# EAGLE design Zio Qwiic Air Quality Sensor CCS811 (EAGLE 9.1.1)
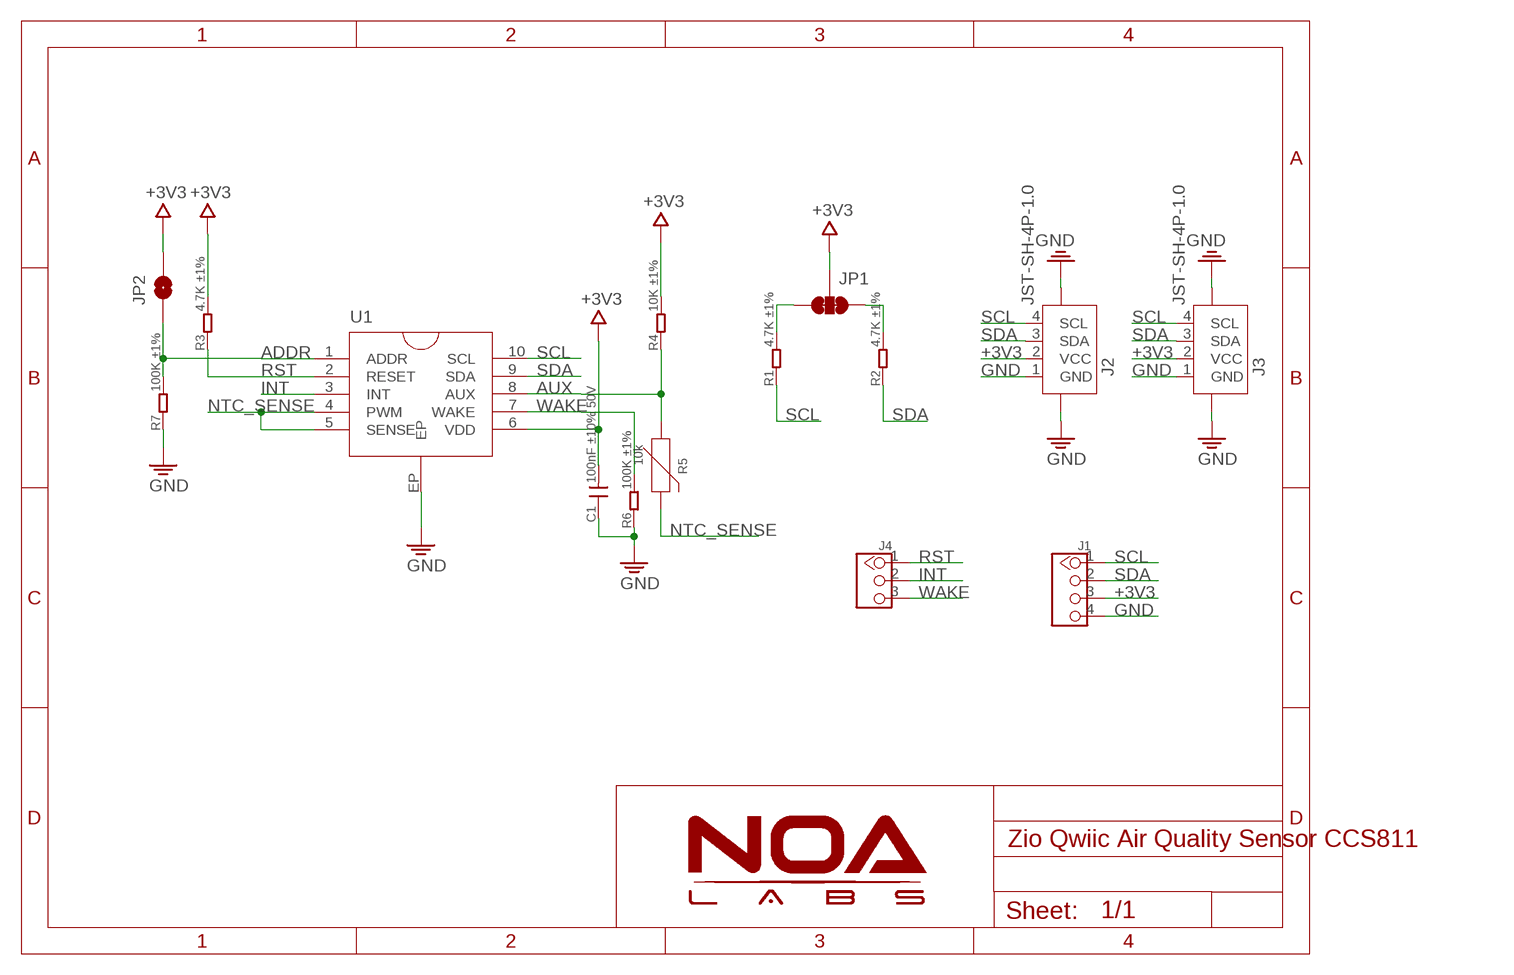
[diagram p0: schematic, sheet 1]

## Parts
C1  100nF ±10% 50V  C-0603  [C0603]
J1  HEADER-4P-60/35MIL  [4P-65/35MIL]
J2  JST-SH-4P-1.0  [JST-SH-4P]
J3  JST-SH-4P-1.0  [JST-SH-4P]
J4  HEADER-3P-2.54  [3P-2.54]
JP1  SMT-JUMPER_3_2-NC_TRACE  [SMT-JUMPER_3_2-NC_TRACE]
JP2  JUMPER-SMT_2_NC_PASTE_NOCREM  [SMT-JUMPER_2_NC_PASTE_SILK_NOCREM]
R1  4.7K ±1%  R-0603  [R0603]
R2  4.7K ±1%  R-0603  [R0603]
R3  4.7K ±1%  R-0603  [R0603]
R4  10K ±1%  R-0603  [R0603]
R5  10k  R-PHOTOVARISTORNTC  [NTC]
R6  100K ±1%  R-0603  [R0603]
R7  100K ±1%  R-0603  [R0603]
U1  CCS811B  [LGA10]

## Nets
+3V3: C1.2 J1.3 J2.2(VCC) J3.2(VCC) JP1.2 JP2.2 R3.2 R4.2 U1.6(VDD)
ADDR: JP2.1 R7.2 U1.1(ADDR)
AUX: R4.1 R5.2 U1.8(AUX)
GND: C1.1 J1.4 J2.1(GND) J2.NC1 J2.NC2 J3.1(GND) J3.NC1 J3.NC2 R6.1 R7.1 U1.EP
INT: J4.2 U1.3(INT)
N$6: JP1.3 R1.2
N$8: JP1.1 R2.2
NTC_SENSE: R5.1 U1.4(PWM) U1.5(SENSE)
RST: J4.1 R3.1 U1.2(RESET)
SCL: J1.1 J2.4(SCL) J3.4(SCL) R1.1 U1.10(SCL)
SDA: J1.2 J2.3(SDA) J3.3(SDA) R2.1 U1.9(SDA)
WAKE: J4.3 R6.2 U1.7(WAKE)

## Library data of the parts
C1 = RCL:C
J1 = Connector_NOA:HEADER-4P
J2 J3 = Connector:JST-SH-4P
J4 = Connector_NOA:HEADER-3P
JP1 = NOA-Jumpers:SMT-JUMPER_3_2-NC_TRACE
JP2 = NOA-Jumpers:JUMPER-SMT_2_NC_PASTE_NOCREM
R1-R4 R6 R7 = RCL:R
R5 = Discretex:R-PHOTOVARISTOR
U1 = IC:CCS811B

## Board
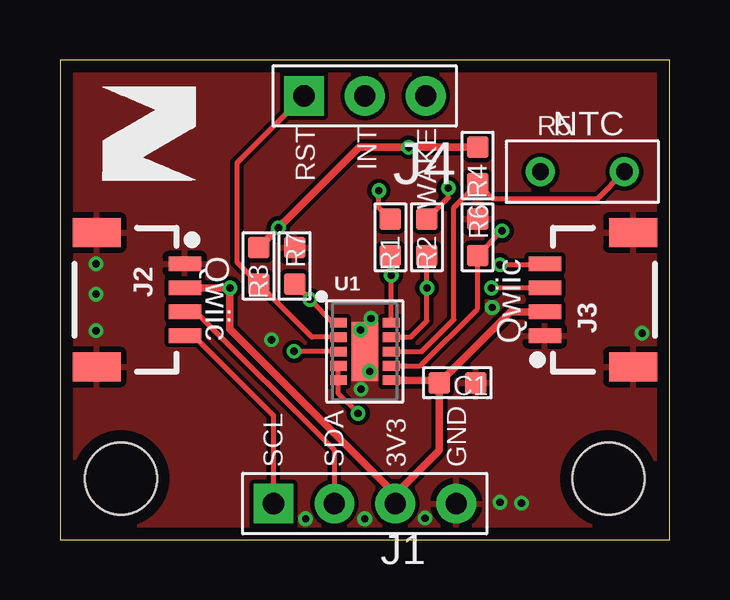
[diagram p1: board, top side]
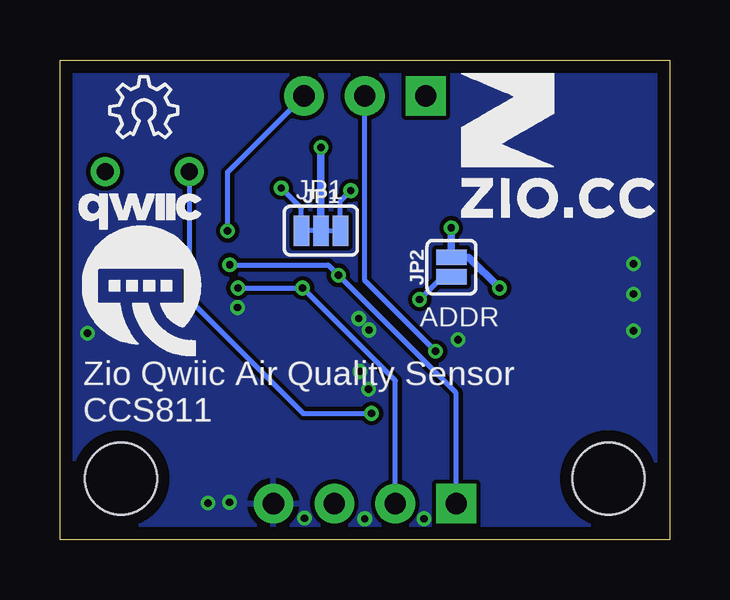
[diagram p2: board, bottom side, seen from below]

Size 25.4 x 20 mm. Coordinates in mm from the lower left corner, seen from the top.
Outline: 0,0 25.4,0 25.4,20 0,20 0,0
Copper layers (1*16): Top 0.035mm / dielectric 1.5mm / Bottom 0.035mm
Design rules "NOA Eagle Rule": minimum track width 7mil, minimum drill 12mil, track to track 7mil, track to pad 7mil, pad to pad 7mil, via to via 7mil, smd to smd 0mil, copper to edge 20mil, drill to drill 10mil, minimum pad ring 10mil, minimum via ring 6mil, stop-mask expansion 2mil, vias tented up to drill 25mil, thermal gap 10mil
Holes 3 mm at 2.54,2.54 22.86,2.54

### Footprints (pad centres in the part's own frame; a part is rotated, then mirrored left to right if it is on the bottom)
C0603 = smd 0.889 x 0.889: 1 -0.762,0; 2 0.762,0
4P-65/35MIL = drill 0.889 pad 1.651 square: 1 0,3.81 | drill 0.889 pad 1.651: 2 0,1.27; 3 0,-1.27; 4 0,-3.81
JST-SH-4P = smd 0.6 x 1.35: 1 1.5,0; 2 0.5,0; 3 -0.5,0; 4 -1.5,0 | smd 1.2 x 2: NC1 -2.8,3.675; NC2 2.8,3.675
3P-2.54 = drill 0.889 pad 1.651 square: 1 0,2.54 | drill 0.889 pad 1.651: 2 0,0; 3 0,-2.54
SMT-JUMPER_3_2-NC_TRACE = smd 0.635 x 1.27: 1 -0.813,0; 2 0,0; 3 0.813,0
SMT-JUMPER_2_NC_PASTE_SILK_NOCREM = smd 0.635 x 1.27: 1 -0.406,0; 2 0.406,0
R0603 = smd 0.889 x 0.889: 1 -0.762,0; 2 0.762,0
NTC = drill 0.7: 1 -1.75,0; 2 1.75,0
LGA10 = smd 0.7 x 0.4: 1 -1.1,1.2; 2 -1.1,0.6; 3 -1.1,0; 4 -1.1,-0.6; 5 -1.1,-1.2; 6 1.1,-1.2; 7 1.1,-0.6; 8 1.1,0; 9 1.1,0.6; 10 1.1,1.2 | smd 1.1 x 2.45: EP 0,0

### Placement (x,y rotation side)
C1  16.56,6.53 180 top
J1  12.7,1.5 90 top
J2  5.2,10 90 top
J3  20.2,10 270 top
J4  12.7,18.5 90 top
JP1  14.53,12.88 0 bottom
JP2  9.09,11.36 90 bottom
R1  13.77,12.61 90 top
R2  15.29,12.61 90 top
R3  8.28,11.41 90 top
R4  17.4,15.6 90 top
R5  21.77,15.34 0 top
R6  17.4,12.61 270 top
R7  9.78,11.41 270 top
U1  12.7,7.84 0 top
U$6  [6MM]  8.71,13.44 0 bottom
U$7  [QWIIC-LOGO-MEDIUM]  22.07,11.1 0 bottom
U$8  [OSHW_6X100_NOTEXT]  23.32,16.76 0 bottom
U$9  [6MM]  1.75,14.96 0 top

### Tracks (layer width: path | path; a pad name or v marks a point on that pad's centre or on a via)
+3V3  (via drill 0.3)
  Top 0.305: U1.6 15.69,6.64 C1.2 | J3.2 18.76,9.5 C1.2 | R3.2 9.32,13.21 | 9.32,13.21 12.46,16.36 v14.53,16.36 R4.2 | v9.1,13 9.31,13.21 9.32,13.21 | J1.3 13.97,1.88 | J2.2 7.08,10.5 | 7.08,10.5 v7.09,10.49 | 7.08,10.5 7.08,8.77 13.8,2.04 | 13.97,1.88 13.8,2.04 | C1.2 15.8,3.71 14.16,2.07 | 14.16,2.07 13.97,1.88 | J1.3 13.97,1.88 | 13.97,1.88 14.16,2.07 | J1.3 13.97,1.88 | 13.97,1.88 13.8,2.04
  Bottom 0.305: JP1.2 v14.53,16.36 | v9.1,13 v9.09,12.99 JP2.2 8.36,11.77 v7.09,10.49
ADDR  (via drill 0.3)
  Top 0.203: U1.1 11.39,9.04 v10.42,10.01 R7.2
  Bottom 0.203: JP2.1 9.47,10.95 v10.42,10.01
AUX
  Top 0.203: U1.8 15.08,7.84 16.41,9.17 16.41,13.84 R4.1 18.01,14.22 22.4,14.22 R5.2
GND  (via drill 0.3)
  other vias: 12.95,9.22 12.52,8.74 12.9,7.01 12.55,6.27 10.24,0.86 12.7,0.86 15.21,0.89 8.81,8.33 1.5,8.71 1.5,10.24 1.5,11.51 19.23,1.52 18.34,1.55 24.26,8.61 18.01,9.68
  pour Bottom: 0,19.99 25.4,19.99 25.4,0 0,0
  pour Top: 0,19.99 25.4,19.99 25.4,0 0,0
INT  (via drill 0.3)
  Top 0.203: U1.3 9.76,7.84 v9.75,7.85
  Bottom 0.203: v9.75,7.85 12.7,10.79 J4.2
N$6  (via drill 0.3)
  Top 0.203: R1.2 13.28,13.85 v13.28,14.55
  Bottom 0.203: JP1.3 13.72,14.12 v13.28,14.55
N$8  (via drill 0.3)
  Top 0.203: R2.2 16.18,14.26 v16.18,14.66
  Bottom 0.203: JP1.1 15.34,13.82 v16.18,14.66
NTC_SENSE  (via drill 0.3)
  Top 0.203: v12.42,5.26 11.6,6.08 U1.5 U1.4
  Bottom 0.203: R5.1 20.02,10.01 15.27,5.26 v12.42,5.26
RST
  Top 0.203: U1.2 10.49,8.44 R3.1 7.37,11.56 7.37,15.71 J4.1
SCL  (via drill 0.3)
  Top 0.203: U1.10 v13.8,11.02 13.8,11.81 R1.1 | J2.4 5.57,8.5 8.89,5.18 J1.1 | J3.4 20.16,11.46 v18.33,11.46
  Bottom 0.203: J1.1 8.89,6.11 v13.8,11.02 14.05,11.27 14.23,11.46 v18.33,11.46
SDA  (via drill 0.3)
  Top 0.203: U1.9 14.61,8.44 15.29,9.12 v15.29,10.49 R2.1 | J2.3 5.66,9.5 11.43,3.73 J1.2 | J3.3 17.99,10.5 v17.98,10.49
  Bottom 0.203: J1.2 11.43,6.63 v15.29,10.49 v17.98,10.49
WAKE  (via drill 0.3)
  Top 0.203: U1.7 15.02,7.24 17.4,9.62 R6.2 18.41,12.86 v18.41,12.88
  Bottom 0.203: v18.41,12.88 18.41,15.32 J4.3

### Text on the board
tPlace: RST | INT | WAKE | NTC | Qwiic | Qwiic | SCL | SDA | 3V3 | GND
bPlace: JP1 | ADDR | Zio Qwiic Air Quality Sensor / CCS811